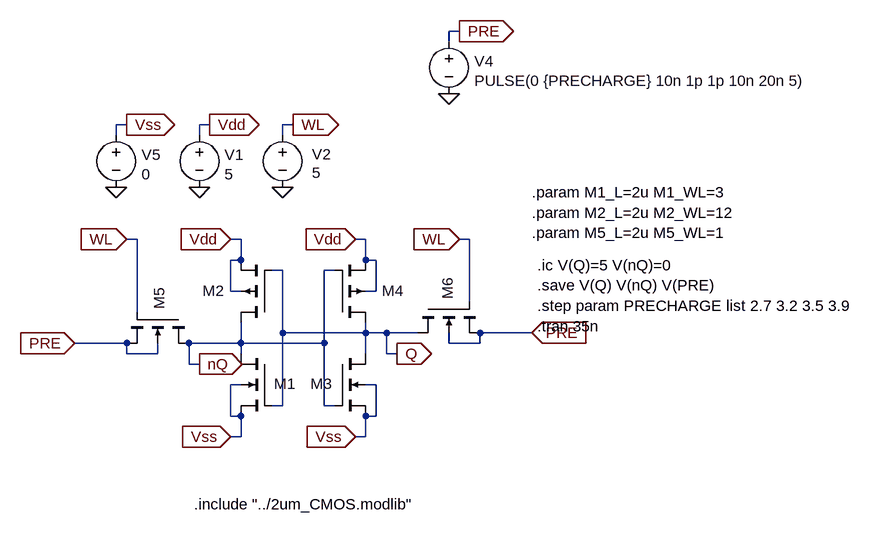
[diagram p0: schematic core.asc]
core.asc, the LTspice schematic file:
Version 4
SHEET 1 1180 1172
WIRE -64 -208 -80 -208
WIRE -80 -192 -80 -208
WIRE -576 -64 -592 -64
WIRE -448 -64 -464 -64
WIRE -320 -64 -336 -64
WIRE -592 -48 -592 -64
WIRE -464 -48 -464 -64
WIRE -336 -48 -336 -64
WIRE -560 112 -576 112
WIRE -400 112 -416 112
WIRE -208 112 -224 112
WIRE -48 112 -64 112
WIRE -400 144 -400 112
WIRE -400 144 -416 144
WIRE -208 144 -208 112
WIRE -192 144 -208 144
WIRE -336 160 -352 160
WIRE -256 160 -272 160
WIRE -416 192 -416 144
WIRE -400 192 -416 192
WIRE -192 192 -192 144
WIRE -192 192 -208 192
WIRE -48 208 -48 112
WIRE -560 224 -560 112
WIRE -336 256 -336 160
WIRE -208 256 -208 240
WIRE -208 256 -336 256
WIRE -176 256 -208 256
WIRE -128 256 -176 256
WIRE 48 256 -32 256
WIRE -576 272 -656 272
WIRE -400 272 -400 240
WIRE -400 272 -480 272
WIRE -272 272 -272 160
WIRE -272 272 -400 272
WIRE -80 272 -80 256
WIRE -32 272 -32 256
WIRE -32 272 -80 272
WIRE -576 288 -576 272
WIRE -528 288 -528 272
WIRE -528 288 -576 288
WIRE -400 288 -400 272
WIRE -208 288 -208 256
WIRE -176 288 -176 256
WIRE -160 288 -176 288
WIRE -480 304 -480 272
WIRE -464 304 -480 304
WIRE -400 336 -416 336
WIRE -192 336 -208 336
WIRE -336 368 -336 256
WIRE -336 368 -352 368
WIRE -272 368 -272 272
WIRE -256 368 -272 368
WIRE -416 384 -416 336
WIRE -400 384 -416 384
WIRE -192 384 -192 336
WIRE -192 384 -208 384
WIRE -400 416 -400 384
WIRE -400 416 -416 416
WIRE -208 416 -208 384
WIRE -208 416 -224 416
FLAG -464 32 0
FLAG -336 32 0
FLAG -448 -64 Vdd
IOPIN -448 -64 Out
FLAG -320 -64 WL
IOPIN -320 -64 Out
FLAG -64 -208 PRE
IOPIN -64 -208 Out
FLAG -80 -112 0
FLAG -416 416 Vss
IOPIN -416 416 In
FLAG -656 272 PRE
IOPIN -656 272 In
FLAG 48 256 PRE
IOPIN 48 256 In
FLAG -576 112 WL
IOPIN -576 112 In
FLAG -64 112 WL
IOPIN -64 112 In
FLAG -416 112 Vdd
IOPIN -416 112 In
FLAG -224 112 Vdd
IOPIN -224 112 In
FLAG -464 304 nQ
IOPIN -464 304 Out
FLAG -160 288 Q
IOPIN -160 288 Out
FLAG -592 32 0
FLAG -576 -64 Vss
IOPIN -576 -64 Out
FLAG -224 416 Vss
IOPIN -224 416 In
SYMBOL pmos4 -352 240 R180
WINDOW 0 73 49 Left 2
WINDOW 3 55 45 Invisible 2
SYMATTR InstName M2
SYMATTR Value P_2u
SYMATTR Value2 l={M2_L} w={M2_L * M2_WL}
SYMBOL nmos4 -352 288 M0
WINDOW 0 -37 46 Left 2
WINDOW 3 -70 42 Invisible 2
SYMATTR InstName M1
SYMATTR Value N_2u
SYMATTR Value2 l={M1_L} w={M1_L * M1_WL}
SYMBOL voltage -464 -64 R0
WINDOW 0 39 46 Left 2
WINDOW 3 39 76 Left 2
SYMATTR InstName V1
SYMATTR Value 5
SYMBOL voltage -336 -64 R0
WINDOW 0 45 45 Left 2
WINDOW 3 45 74 Left 2
SYMATTR InstName V2
SYMATTR Value 5
SYMBOL voltage -80 -208 R0
WINDOW 0 39 46 Left 2
WINDOW 3 39 76 Left 2
SYMATTR InstName V4
SYMATTR Value PULSE(0 {PRECHARGE} 10n 1p 1p 10n 20n 5)
SYMBOL pmos4 -256 240 M180
WINDOW 0 73 49 Left 2
WINDOW 3 55 45 Invisible 2
SYMATTR InstName M4
SYMATTR Value P_2u
SYMATTR Value2 l={M2_L} w={M2_L * M2_WL}
SYMBOL nmos4 -256 288 R0
WINDOW 0 -37 46 Left 2
WINDOW 3 -70 42 Invisible 2
SYMATTR InstName M3
SYMATTR Value N_2u
SYMATTR Value2 l={M1_L} w={M1_L * M1_WL}
SYMBOL nmos4 -480 224 R90
WINDOW 0 -37 46 Left 2
WINDOW 3 -70 42 Invisible 2
SYMATTR InstName M5
SYMATTR Value N_2u
SYMATTR Value2 l={M5_L} w={M5_L * M5_WL}
SYMBOL nmos4 -128 208 M90
WINDOW 0 -37 46 Left 2
WINDOW 3 -70 42 Invisible 2
SYMATTR InstName M6
SYMATTR Value N_2u
SYMATTR Value2 l={M5_L} w={M5_L * M5_WL}
SYMBOL voltage -592 -64 R0
WINDOW 0 39 46 Left 2
WINDOW 3 39 76 Left 2
SYMATTR InstName V5
SYMATTR Value 0
TEXT -472 520 Left 2 !.include "../2um_CMOS.modlib"
TEXT 56 152 Left 2 !.ic V(Q)=5 V(nQ)=0\n.save V(Q) V(nQ) V(PRE)\n.step param PRECHARGE list 2.7 3.2 3.5 3.9\n.tran 35n
TEXT 48 40 Left 2 !.param M1_L=2u M1_WL=3\n.param M2_L=2u M2_WL=12\n.param M5_L=2u M5_WL=1

The netlist it stands for:
* core.asc
M2 nQ Q Vdd Vdd P_2u l={M2_L} w={M2_L * M2_WL}
M1 nQ Q Vss Vss N_2u l={M1_L} w={M1_L * M1_WL}
V1 Vdd 0 5
V2 WL 0 5
V4 PRE 0 PULSE(0 {PRECHARGE} 10n 1p 1p 10n 20n 5)
M4 Q nQ Vdd Vdd P_2u l={M2_L} w={M2_L * M2_WL}
M3 Q nQ Vss Vss N_2u l={M1_L} w={M1_L * M1_WL}
M5 nQ WL PRE PRE N_2u l={M5_L} w={M5_L * M5_WL}
M6 Q WL PRE PRE N_2u l={M5_L} w={M5_L * M5_WL}
V5 Vss 0 0
.model NMOS NMOS
.model PMOS PMOS
.lib standard.mos
.include "../2um_CMOS.modlib"
.ic V(Q)=5 V(nQ)=0
.save V(Q) V(nQ) V(PRE)
.step param PRECHARGE list 2.7 3.2 3.5 3.9
.tran 35n
.param M1_L=2u M1_WL=3
.param M2_L=2u M2_WL=12
.param M5_L=2u M5_WL=1
.backanno
.end